# Altium schematic sheet DAC.SchDoc
size 420 x 297 mm; Address1: Address1; Address2: Address2; Address3: Address3; Address4: Address4; DocumentNumber: АБВГ.123456.001 Э3; SheetNumber: 1; Scale: 1:1; DocumentType: Схема электрическая принципиальная; FirstReferrence: АБВГ.123456.001
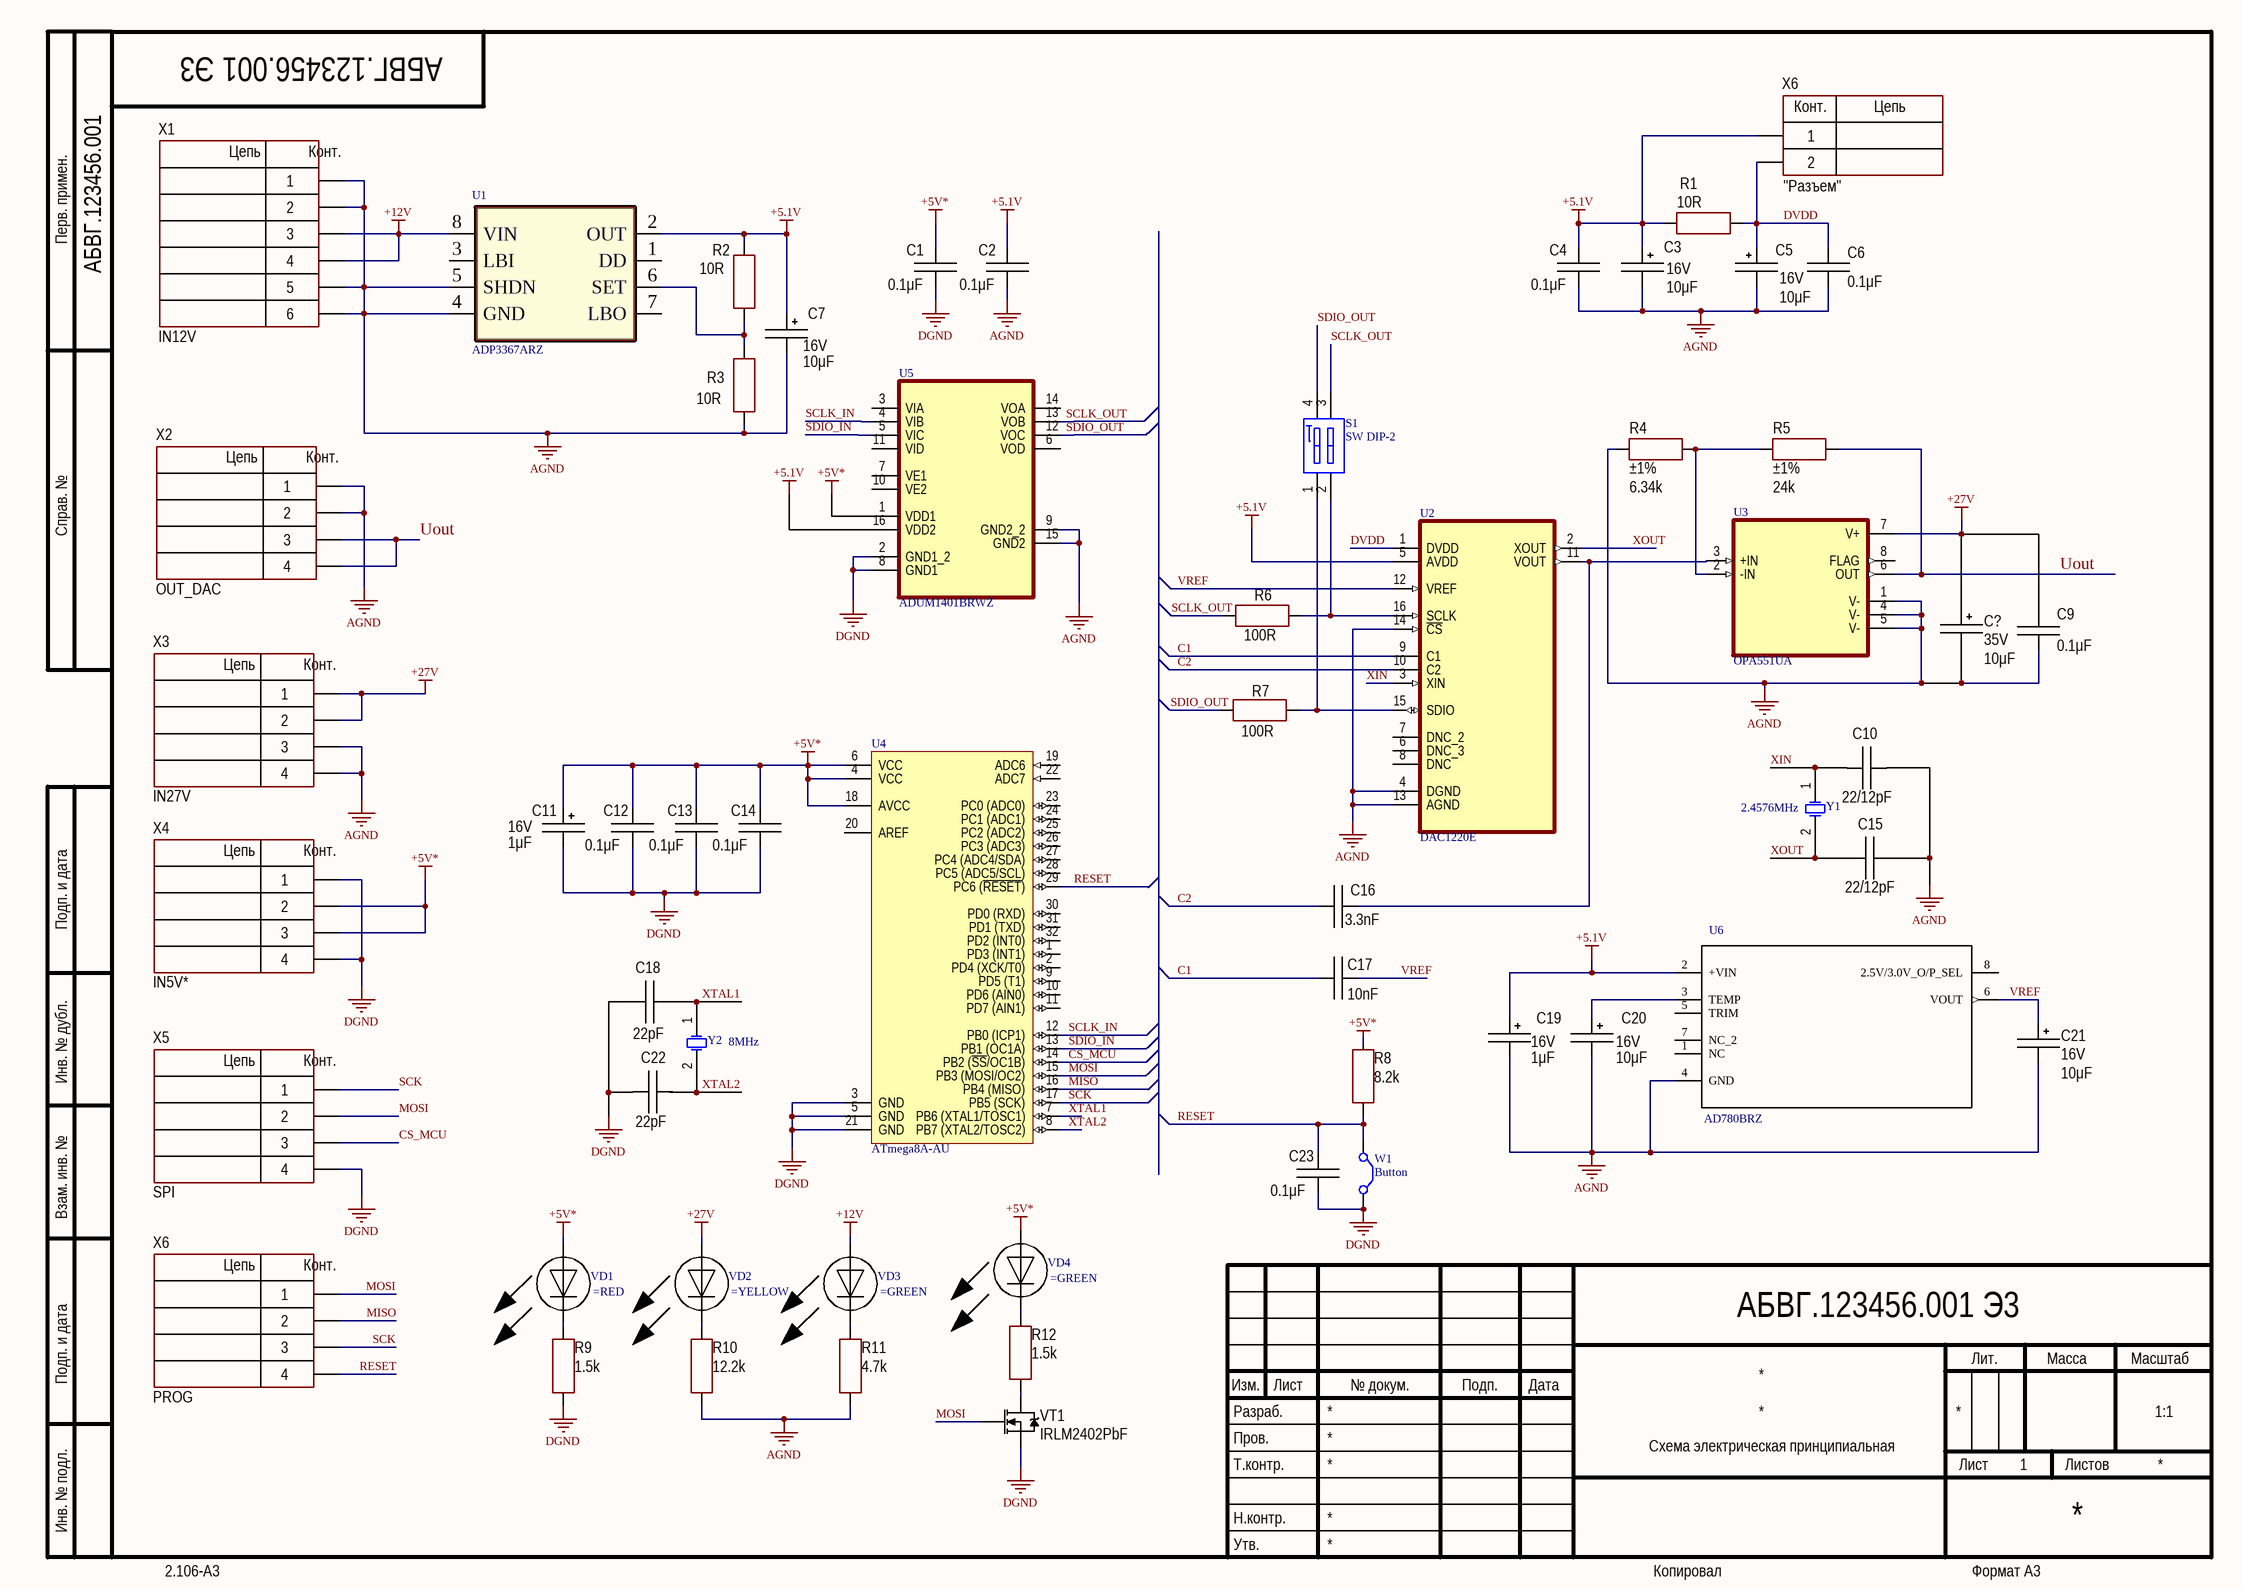
[diagram p0: DAC.SchDoc]

## Parts
(Parts that share a designator on the sheet are numbered #1, #2 ... from top to bottom, then left to right.)
C1  value 0.1μF  [CAP: 1206]
C2  value 0.1μF  [CAP: 1206]
C3  value 10μF  Voltage: 16V  [CAP: TANTAL-A]
C4  value 0.1μF  [CAP: 1206]
C5  value 10μF  Voltage: 16V  [CAP: TANTAL-A]
C6  value 0.1μF  [CAP: 1206]
C7  value 10μF  Voltage: 16V  [CAP: TANTAL-A]
C9  value 0.1μF  [CAP: 1206]
C10  value 22/12pF  [CAP: 1206]
C11  value 1μF  Voltage: 16V  [CAP: TANTAL-A]
C12  value 0.1μF  [CAP: 1206]
C13  value 0.1μF  [CAP: 1206]
C14  value 0.1μF  [CAP: 1206]
C15  value 22/12pF  [CAP: 1206]
C16  value 3.3nF  [CAP: 1206]
C17  value 10nF  [CAP: 1206]
C18  value 22pF  [CAP: 1206]
C19  value 1μF  Voltage: 16V  [CAP: TANTAL-A]
C20  value 10μF  Voltage: 16V  [CAP: TANTAL-A]
C21  value 10μF  Voltage: 16V  [CAP: TANTAL-A]
C22  value 22pF  [CAP: 1206]
C23  value 0.1μF  [CAP: 1206]
C?  value 10μF  Voltage: 35V  [CAP: D5C2H11]
R1  value 10R  [RES: 1206]
R2  value 10R  [RES: 1206]
R3  value 10R  [RES: 1206]
R4  value 6.34k  Tolerance: ±1%  [RES: 1206]
R5  value 24k  Tolerance: ±1%  [RES: 1206]
R6  value 100R  [RES: 1206]
R7  value 100R  [RES: 1206]
R8  value 8.2k  [RES: 1206]
R9  value 1.5k  [RES: 1206]
R10  value 12.2k  [RES: 1206]
R11  value 4.7k  [RES: 1206]
R12  value 1.5k  [RES: 1206]
S1  SW DIP-2  [DIP-4]
U1  ADP3367ARZ  [SOIC127P600X175-8N]
U2  DAC1220E  [SOP63P600X175-16N]
U3  OPA551UA  [SOIC127P599X175-8N]
U4  ATmega8A-AU  [32A_L]
U5  ADUM1401BRWZ  [SOIC127P1032X265-16N]
U6  AD780BRZ  [*SOIC127P600X175-8N]
VD1  LED  [LED 0805]  (value not drawn)
VD2  LED  [LED 0805]  (value not drawn)
VD3  LED  [LED 0805]  (value not drawn)
VD4  LED  [LED 0805]  (value not drawn)
VT1  PartNumber: IRLM2402PbF  [SOT23]
W1  Button  [RAD-0.2]
X1  CommentText: IN12V  [CON: PLS-6]
X2  CommentText: OUT_DAC  [CON: PLS-4]
X3  CommentText: IN27V  [CON: PLS-4]
X4  CommentText: IN5V*  [CON: PLS-4]
X5  CommentText: SPI  [CON: PLS-4]
X6#1  CommentText: "Разъем"  [CON: PLS-2]
X6#2  CommentText: PROG  [CON: PLS-4]
Y1  2.4576MHz  [R38]
Y2  8MHz  [R38]

## Nets
+5.1V: C2.2 C3.1 C4.2 C7.1 C19.1 R1.2 R2.2 U1.2(OUT) U2.5(AVDD) U5.16(VDD2) U6.2(+VIN) X6#1.1
+5V*: C1.2 C11.1 C12.2 C13.2 C14.2 R8.1 U4.4(VCC) U4.6(VCC) U4.18(AVCC) U5.1(VDD1) VD1.1 VD4.1 X4.2 X4.3
+12V: U1.8(VIN) VD3.1 X1.3 X1.4
+27V: C9.2 C?.1 U3.7(V+) VD2.1 X3.1 X3.2
AGND: C2.1 C3.2 C4.1 C5.2 C6.1 C7.2 C9.1 C10.1 C15.1 C19.2 C20.2 C21.2 C?.2 R3.1 R4.2 R10.1 R11.1 U1.4(GND) U1.5(SHDN) U2.4(DGND) U2.13(AGND) U2.14(~{CS}) U3.1(V-) U3.4(V-) U3.5(V-) U5.9(GND2_2) U5.15(GND2) U6.4(GND) X1.1 X1.2 X1.5 X1.6 X2.1 X2.2 X3.3 X3.4
DGND: C1.1 C11.2 C12.1 C13.1 C14.1 C18.2 C22.2 C23.1 R9.1 U4.3(GND) U4.5(GND) U4.21(GND) U5.2(GND1_2) U5.8(GND1) VT1.3(S) W1.2(C2) X4.1 X4.4 X5.4
C1: C17.2 U2.9(C1)
C2: C16.2 U2.10(C2)
CS_MCU: U4.14(PB2_(~{SS}/OC1B)) X5.3
DVDD: C5.1 C6.2 R1.1 U2.1(DVDD) X6#1.2
MISO: U4.16(PB4_(MISO)) X6#2.2
MOSI: U4.15(PB3_(MOSI/OC2)) VT1.1(G) X5.2 X6#2.1
RESET: C23.2 R8.2 U4.29(PC6_(~{RESET})) W1.1(C1) X6#2.4
SCK: U4.17(PB5_(SCK)) X5.1 X6#2.3
SCLK_IN: U4.12(PB0_(ICP1)) U5.4(VIB)
SCLK_OUT: R6.2 S1.3(B2) U5.13(VOB)
SDIO_IN: U4.13(PB1_(OC1A)) U5.5(VIC)
SDIO_OUT: R7.2 S1.4(B1) U5.12(VOC)
Uout: R5.2 U3.6(OUT) X2.3 X2.4
VREF: C17.1 C21.1 U2.12(VREF) U6.6(VOUT)
XIN: C10.2 U2.3(XIN) Y1.1(OSC1)
XOUT: C15.2 U2.2(XOUT) Y1.2(OSC2)
XTAL1: C18.1 U4.7(PB6_(XTAL1/TOSC1)) Y2.1(OSC1)
XTAL2: C22.1 U4.8(PB7_(XTAL2/TOSC2)) Y2.2(OSC2)
NetC16_1: C16.1 U2.11(VOUT) U3.3(+IN)
NetC20_1: C20.1 U6.3(TEMP)
NetR2_1: R2.1 R3.2 U1.6(SET)
NetR4_1: R4.1 R5.1 U3.2(-IN)
NetR6_1: R6.1 S1.2(A2) U2.16(SCLK)
NetR7_1: R7.1 S1.1(A1) U2.15(SDIO)
NetR9_2: R9.2 VD1.2
NetR10_2: R10.2 VD2.2
NetR11_2: R11.2 VD3.2
NetR12_1: R12.1 VT1.2(D)
NetR12_2: R12.2 VD4.2

Not connected (* = marked no-connect by the designer): U1 1(DD) 3(LBI) 7(LBO); U2 6(DNC_3) 7(DNC_2) 8(DNC); U3 8(FLAG); U4 1(PD3_(INT1)) 2(PD4_(XCK/T0)) 9(PD5_(T1)) 10(PD6_(AIN0)) 11(PD7_(AIN1)) 19(ADC6) 20(AREF) 22(ADC7) 23(PC0_(ADC0)) 24(PC1_(ADC1)) 25(PC2_(ADC2)) 26(PC3_(ADC3)) 27(PC4_(ADC4/SDA)) 28(PC5_(ADC5/SCL)) 30(PD0_(RXD)) 31(PD1_(TXD)) 32(PD2_(INT0)); U5 3(VIA) 6(VOD) 7(VE1) 10(VE2) 11(VID) 14(VOA); U6 1(NC) 5(TRIM) 7(NC_2) 8(2.5V/3.0V_O/P_SEL)

## Notes on the sheet
- Перв. примен.
- Справ. №
- Подп. и дата
- Инв. № дубл.
- Взам. инв. №
- Разраб.
- Изм.
- Лист
- № докум.
- Подп.
- Дата
- Лит.
- Масса
- Масштаб
- Пров.
- Т.контр.
- Листов
- Инв. № подл.
- Утв.
- Н.контр.
- 2.106-A3
- Копировал
- Формат А3
- (in symbol PLS-2) Конт.; Цепь
- (in symbol PLS-4) Цепь; Конт.
- (in symbol PLS-6) Цепь; Конт.

## Library data of the parts
C1 C2 C4 C6 C9 C12-C14 C23 = Ceramic_1206: Manufacturer: Yageo; PartNumber: CC1206KRX7R9BB104; ValueManufacturerPartNumber: Ceramic capacitor, 0.1μF, X7R, ±10%, 50V, 1206, -55...+125°C; TypeCapacitor: Ceramic capacitor; Tolerance: ±10%; TypeDielectric: X7R; Voltage: 50V; Package: 1206; HelpURL: https://www.digikey.com/product-detail/en/yageo/CC1206KRX7R9BB104/311-1179-1-ND/303089; Temperature: -55...+125°C
C3 C5 C7 C20 C21 = Tantal_A: Manufacturer: AVX; PartNumber: F930J107KAAAJ6; ValueManufacturerPartNumber: Tantalum capacitor, 10μF, 16V, ±10%, 2Ohm, case A (3216), -55...+125°C; Impedance: 2Ohm; Tolerance: ±10%; TypeDielectric: X7R; TypeCapacitor: Tantalum capacitor; Package: case A (3216); HelpURL: https://www.digikey.com/product-detail/en/avx-corporation/F930J107KAAAJ6/478-12404-1-ND/9645231; Temperature: -55...+125°C
C10 C15 = Ceramic_1206: Manufacturer: Yageo; PartNumber: CC1206KRX7R9BB104; ValueManufacturerPartNumber: Ceramic capacitor, 22/12pF, X7R, ±10%, 50V, 1206, -55...+125°C; TypeCapacitor: Ceramic capacitor; Tolerance: ±10%; TypeDielectric: X7R; Voltage: 50V; Package: 1206; HelpURL: https://www.digikey.com/product-detail/en/yageo/CC1206KRX7R9BB104/311-1179-1-ND/303089; Temperature: -55...+125°C
C11 C19 = Tantal_A: Manufacturer: AVX; PartNumber: F930J107KAAAJ6; ValueManufacturerPartNumber: Tantalum capacitor, 1μF, 16V, ±10%, 2Ohm, case A (3216), -55...+125°C; Impedance: 2Ohm; Tolerance: ±10%; TypeDielectric: X7R; TypeCapacitor: Tantalum capacitor; Package: case A (3216); HelpURL: https://www.digikey.com/product-detail/en/avx-corporation/F930J107KAAAJ6/478-12404-1-ND/9645231; Temperature: -55...+125°C
C16 = Ceramic_1206: Manufacturer: Yageo; PartNumber: CC1206KRX7R9BB104; ValueManufacturerPartNumber: Ceramic capacitor, 3.3nF, X7R, ±10%, 50V, 1206, -55...+125°C; TypeCapacitor: Ceramic capacitor; Tolerance: ±10%; TypeDielectric: X7R; Voltage: 50V; Package: 1206; HelpURL: https://www.digikey.com/product-detail/en/yageo/CC1206KRX7R9BB104/311-1179-1-ND/303089; Temperature: -55...+125°C
C17 = Ceramic_1206: Manufacturer: Yageo; PartNumber: CC1206KRX7R9BB104; ValueManufacturerPartNumber: Ceramic capacitor, 10nF, X7R, ±10%, 50V, 1206, -55...+125°C; TypeCapacitor: Ceramic capacitor; Tolerance: ±10%; TypeDielectric: X7R; Voltage: 50V; Package: 1206; HelpURL: https://www.digikey.com/product-detail/en/yageo/CC1206KRX7R9BB104/311-1179-1-ND/303089; Temperature: -55...+125°C
C18 C22 = Ceramic_1206: Manufacturer: Yageo; PartNumber: CC1206KRX7R9BB104; ValueManufacturerPartNumber: Ceramic capacitor, 22pF, X7R, ±10%, 50V, 1206, -55...+125°C; TypeCapacitor: Ceramic capacitor; Tolerance: ±10%; TypeDielectric: X7R; Voltage: 50V; Package: 1206; HelpURL: https://www.digikey.com/product-detail/en/yageo/CC1206KRX7R9BB104/311-1179-1-ND/303089; Temperature: -55...+125°C
C? = Aluminium: Manufacturer: Wurth; PartNumber: 860080475013; ValueManufacturerPartNumber: Aluminium capacitor, 10μF, 35V, ±20%, 54mOhm, 14x10x5 mm, -55...+105°C; TypeCapacitor: Aluminium capacitor; Tolerance: ±20%; Impedance: 54mOhm; Package: 14x10x5 mm; HelpURL: https://www.digikey.com/product-detail/en/wurth-electronics-inc/860080475013/732-9029-1-ND/5728972; Temperature: -55...+105°C
R1-R3 = Resistor_1206: Manufacturer: Yageo; PartNumber: RC1206JR-07100RL; ValueManufacturerPartNumber: Resistor film, 10R, ±5%, 1206, 0.25W, -55...+125°C; TypeResistor: Resistor film; Power: 0.25W; Tolerance: ±5%; Package: 1206; HelpURL: https://www.digikey.com/product-detail/en/yageo/RC1206JR-07100RL/311-100ERCT-ND/732153; Temperature: -55...+125°C
R4 = Resistor_1206: Manufacturer: Yageo; PartNumber: RC1206JR-07100RL; ValueManufacturerPartNumber: Resistor film, 6.34k, ±1%, 1206, 0.25W, -55...+125°C; TypeResistor: Resistor film; Power: 0.25W; Package: 1206; HelpURL: https://www.digikey.com/product-detail/en/yageo/RC1206JR-07100RL/311-100ERCT-ND/732153; Temperature: -55...+125°C
R5 = Resistor_1206: Manufacturer: Yageo; PartNumber: RC1206JR-07100RL; ValueManufacturerPartNumber: Resistor film, 24k, ±1%, 1206, 0.25W, -55...+125°C; TypeResistor: Resistor film; Power: 0.25W; Package: 1206; HelpURL: https://www.digikey.com/product-detail/en/yageo/RC1206JR-07100RL/311-100ERCT-ND/732153; Temperature: -55...+125°C
R6 R7 = Resistor_1206: Manufacturer: Yageo; PartNumber: RC1206JR-07100RL; ValueManufacturerPartNumber: Resistor film, 100R, ±5%, 1206, 0.25W, -55...+125°C; TypeResistor: Resistor film; Power: 0.25W; Tolerance: ±5%; Package: 1206; HelpURL: https://www.digikey.com/product-detail/en/yageo/RC1206JR-07100RL/311-100ERCT-ND/732153; Temperature: -55...+125°C
R8 = Resistor_1206: Manufacturer: Yageo; PartNumber: RC1206JR-07100RL; ValueManufacturerPartNumber: Resistor film, 8.2k, ±5%, 1206, 0.25W, -55...+125°C; TypeResistor: Resistor film; Power: 0.25W; Tolerance: ±5%; Package: 1206; HelpURL: https://www.digikey.com/product-detail/en/yageo/RC1206JR-07100RL/311-100ERCT-ND/732153; Temperature: -55...+125°C
R9 R12 = Resistor_1206: Manufacturer: Yageo; PartNumber: RC1206JR-07100RL; ValueManufacturerPartNumber: Resistor film, 1.5k, ±5%, 1206, 0.25W, -55...+125°C; TypeResistor: Resistor film; Power: 0.25W; Tolerance: ±5%; Package: 1206; HelpURL: https://www.digikey.com/product-detail/en/yageo/RC1206JR-07100RL/311-100ERCT-ND/732153; Temperature: -55...+125°C
R10 = Resistor_1206: Manufacturer: Yageo; PartNumber: RC1206JR-07100RL; ValueManufacturerPartNumber: Resistor film, 12.2k, ±5%, 1206, 0.25W, -55...+125°C; TypeResistor: Resistor film; Power: 0.25W; Tolerance: ±5%; Package: 1206; HelpURL: https://www.digikey.com/product-detail/en/yageo/RC1206JR-07100RL/311-100ERCT-ND/732153; Temperature: -55...+125°C
R11 = Resistor_1206: Manufacturer: Yageo; PartNumber: RC1206JR-07100RL; ValueManufacturerPartNumber: Resistor film, 4.7k, ±5%, 1206, 0.25W, -55...+125°C; TypeResistor: Resistor film; Power: 0.25W; Tolerance: ±5%; Package: 1206; HelpURL: https://www.digikey.com/product-detail/en/yageo/RC1206JR-07100RL/311-100ERCT-ND/732153; Temperature: -55...+125°C
S1 = SW DIP-2: DIP Switch, 2 Position, SPST; Published: 24-Mar-1999; LatestRevisionDate: 17-Jul-2002; LatestRevisionNote: Re-released for DXP Platform.; PackageReference: DIP-4; Publisher: Altium Limited
U2 = DAC1220E: 20-Bit Delta-Sigma Low Power Digital-To-Analog Converter 16-SSOP -40 to 85; MF: Texas Instruments; MP: DAC1220E; Package: SSOP-16 Texas Instruments; Purchase-URL: https://pricing.snapeda.com/search/part/DAC1220E/?ref=eda; Price: None; Value: *; SnapEDA_Link: https://www.snapeda.com/parts/DAC1220E/Texas%20Instruments/view-part/52026/?ref=snap; Availability: Warning
U3 = OPA551UA: High-current (380mA Typ), high-voltage (60V), operational amplifier 8-SOIC -40 to 125; MF: Texas Instruments; SnapEDA_Link: https://www.snapeda.com/parts/OPA551UA/Texas%20Instruments/view-part/9566/?ref=snap; Price: None; MP: OPA551UA; Package: SOIC-8 Texas Instruments; Value: *; Availability: Unavailable; Purchase-URL: https://pricing.snapeda.com/search/part/OPA551UA/?ref=eda
U4 = ATmega8A-AU: 8-bit AVR Microcontroller, 8KB Flash, 512 Bytes EEPROM, 1KB SRAM, 32-pin TQFP, Industrial Grade (-40°C to 85°C); Published: 1-Apr-2010; DatasheetVersion: revC, Jul-2009; PackageVersion: revB, Oct-2001; PackageReference: 32A; Publisher: Altium Limited; PackageDescription: 32-Lead, 7x7x1.0 mm Body, 0.8mm Lead Pitch, Thin Profile Plastic Quad Flat Package (TQFP); Supplier 1: Digi-Key; Supplier Part Number 1: ATMEGA8A-AU-ND; Supplier 2: Farnell; Supplier Part Number 2: 1748532; Supplier 3: Mouser; Supplier Part Number 3: 556-ATMEGA8A-AU; Code_JEDEC: MS-026-ABA; ComponentLink1Description: Manufacturer Link; ComponentLink1URL: http://www.atmel.com/products/avr/default.asp?; ComponentLink2Description: ATmega8A Datasheet; ComponentLink2URL: http://www.atmel.com/dyn/resources/prod_documents/doc8159.pdf; ComponentLink3Description: ATmega8A Summary; ComponentLink3URL: http://www.atmel.com/dyn/resources/prod_documents/8159S.pdf; ComponentLink4Description: Atmel.com Home; ComponentLink4URL: http://www.atmel.com
U5 = ADUM1401BRWZ: General Purpose Digital Isolator 2500Vrms 4 Channel 10Mbps 25kV/Âµs CMTI 16-SOIC _0.295, 7.50mm Width_; MF: Analog Devices; SnapEDA_Link: https://www.snapeda.com/parts/ADUM1401BRWZ/Analog%20Devices%20Inc./view-part/1210796/?ref=snap; Package: SOIC WIDE-16 Analog Devices; Price: None; Value: *; MP: ADUM1401BRWZ; Availability: Unavailable
VT1 = MOSFET_N_123: Manufacturer: Infineon Technologies; ValueManufacturerPartNumber: MOSFET N-channel transistor, 80V, 7A, 9.1nC, 2.5W, 34mOhm, 756pF, 8-TDSON, -55...+150°C; TypeTransistor: MOSFET N-channel transistor; VoltageDS: 80V; CurrentDS: 7A; RDS: 34mOhm; GateCharge: 9.1nC; InputCapacitor: 756pF; MaxPower: 2.5W; Package: 8-TDSON; HelpURL: https://www.digikey.com/product-detail/en/infineon-technologies/BSC340N08NS3GATMA1/BSC340N08NS3GATMA1TR-ND/2080655; Temperature: -55...+150°C
W1 = Jumper: Jumper Wire; Published: 24-Mar-1999; LatestRevisionDate: 17-Jul-2002; LatestRevisionNote: Re-released for DXP Platform.; PackageReference: RAD-0.2; Publisher: Altium Limited; PackageDescription: Radial Cap, Thru-Hole; 2 Leads; 0.2 in Pin Spacing
X1 = PLS-6: Manufacturer: Connfly; ValueManufacturerPartNumber: Connector, 6pin, 2.54mm, 500VAC, 3A; TypeConnector: Connector; VoltageMax: 500VAC; Pitch: 2.54mm; CurrentMax: 3A; Multichannel: 6pin; HelpURL: https://www.chipdip.ru/product/pls-6; PartNumber: PLS-6
X2-X5 X6#2 = PLS-4: Manufacturer: Connfly; ValueManufacturerPartNumber: Connector, 4pin, 2.54mm, 500VAC, 3A; TypeConnector: Connector; VoltageMax: 500VAC; Pitch: 2.54mm; CurrentMax: 3A; Multichannel: 4pin; HelpURL: https://www.chipdip.ru/product/pls-4; PartNumber: PLS-4
X6#1 = PLS-2: Manufacturer: Connfly; ValueManufacturerPartNumber: Connector, 2pin, 2.54mm, 500VAC, 3A; TypeConnector: Connector; VoltageMax: 500VAC; Pitch: 2.54mm; CurrentMax: 3A; Multichannel: 2pin; HelpURL: https://www.chipdip.ru/product/pls-2; PartNumber: PLS-2
Y1 Y2 = XTAL: Crystal Oscillator; Published: 8-Jun-2000; LatestRevisionDate: 17-Jul-2002; LatestRevisionNote: Re-released for DXP Platform.; PackageReference: R38; Publisher: Altium Limited; PackageDescription: Crystal, Thru-Hole; 2 Leads; Body 3.1 x 8.2 mm (Dia.xH)
U6 = AD780BRZ: Check_prices: https://www.snapeda.com/parts/AD780BRZ/Analog%20Devices%20Inc./view-part/11742/?ref=eda; SnapEDA_Link: https://www.snapeda.com/parts/AD780BRZ/Analog%20Devices%20Inc./view-part/11742/?ref=snap; Value: *
VD1-VD4 = LED
  VD1: COLOR: =RED
  VD2: COLOR: =YELLOW
  VD3 VD4: COLOR: =GREEN